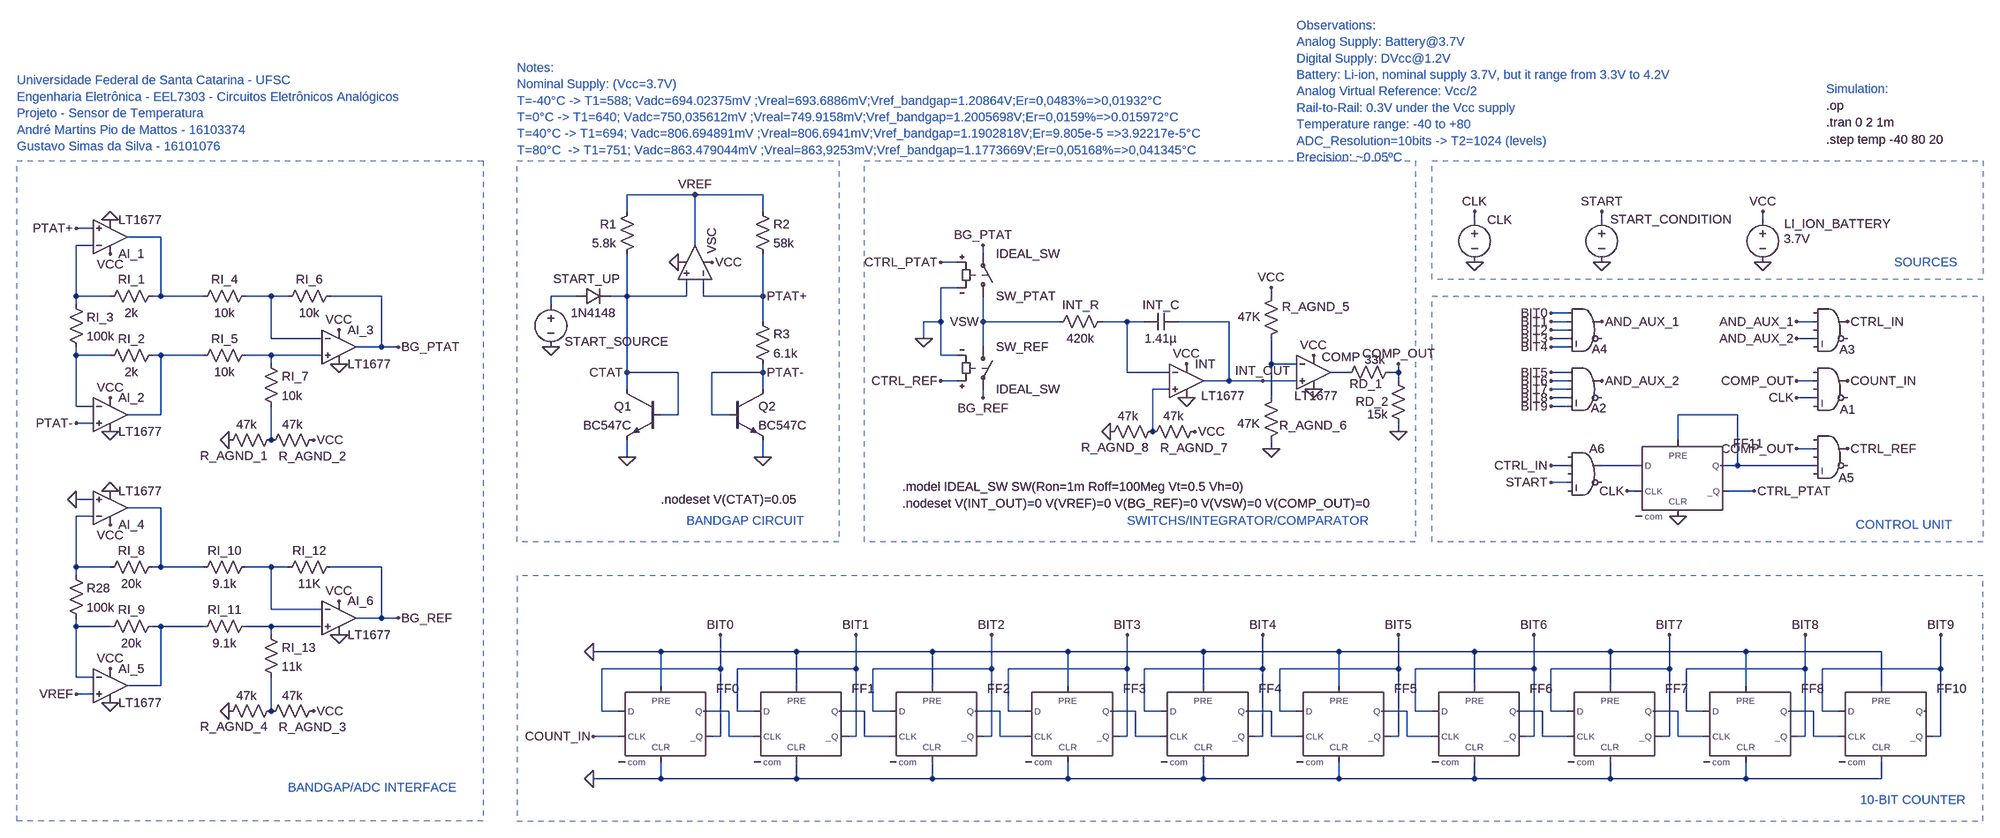
[diagram p0: schematic Temperature_Sensor_Release.asc]
Temperature_Sensor_Release.asc, the LTspice schematic file:
Version 4
SHEET 1 4048 2852
WIRE -1328 -32 -1456 -32
WIRE -1200 -32 -1328 -32
WIRE -1456 0 -1456 -32
WIRE -1200 0 -1200 -32
WIRE 144 16 144 0
WIRE 384 16 384 0
WIRE 688 16 688 0
WIRE -2464 32 -2496 32
WIRE -2336 48 -2400 48
WIRE -2464 64 -2496 64
WIRE -1328 64 -1328 -32
WIRE -784 80 -784 64
WIRE -832 96 -864 96
WIRE -832 144 -864 144
WIRE -2496 160 -2496 64
WIRE -2432 160 -2496 160
WIRE -2336 160 -2336 48
WIRE -2336 160 -2352 160
WIRE -2256 160 -2336 160
WIRE -2128 160 -2176 160
WIRE -2096 160 -2128 160
WIRE -1920 160 -2016 160
WIRE -1552 160 -1600 160
WIRE -1456 160 -1456 80
WIRE -1456 160 -1488 160
WIRE -1344 160 -1344 128
WIRE -1344 160 -1456 160
WIRE -1312 160 -1312 128
WIRE -1200 160 -1200 80
WIRE -1200 160 -1312 160
WIRE -240 160 -240 144
WIRE -2496 176 -2496 160
WIRE -1600 176 -1600 160
WIRE 320 192 288 192
WIRE -1200 208 -1200 160
WIRE -864 208 -864 144
WIRE -864 208 -896 208
WIRE -784 208 -784 160
WIRE -640 208 -784 208
WIRE -512 208 -560 208
WIRE -480 208 -512 208
WIRE -320 208 -416 208
WIRE 320 208 288 208
WIRE 784 208 752 208
WIRE 320 224 288 224
WIRE -2128 240 -2128 160
WIRE -2032 240 -2128 240
WIRE -896 240 -896 208
WIRE 320 240 288 240
WIRE 784 240 752 240
WIRE -1920 256 -1920 160
WIRE -1920 256 -1968 256
WIRE -1888 256 -1920 256
WIRE -784 256 -784 208
WIRE 320 256 288 256
WIRE -2496 272 -2496 256
WIRE -2432 272 -2496 272
WIRE -2336 272 -2352 272
WIRE -2256 272 -2336 272
WIRE -2128 272 -2176 272
WIRE -2032 272 -2128 272
WIRE -864 272 -864 208
WIRE -832 272 -864 272
WIRE -2128 288 -2128 272
WIRE -240 288 -240 240
WIRE -192 288 -240 288
WIRE -1456 304 -1456 160
WIRE -1360 304 -1456 304
WIRE -1200 304 -1200 288
WIRE -1200 304 -1296 304
WIRE -512 304 -512 208
WIRE -432 304 -512 304
WIRE -96 304 -128 304
WIRE 0 304 0 288
WIRE 0 304 -16 304
WIRE 320 304 288 304
WIRE -832 320 -864 320
WIRE -320 320 -320 208
WIRE -320 320 -368 320
WIRE -256 320 -320 320
WIRE -192 320 -256 320
WIRE 0 320 0 304
WIRE 320 320 288 320
WIRE 784 320 752 320
WIRE -1456 336 -1456 304
WIRE -1200 336 -1200 304
WIRE -432 336 -464 336
WIRE 320 336 288 336
WIRE -784 352 -784 336
WIRE -240 352 -240 288
WIRE 320 352 288 352
WIRE 784 352 752 352
WIRE -2496 368 -2496 272
WIRE -2464 368 -2496 368
WIRE 320 368 288 368
WIRE -2336 384 -2336 272
WIRE -2336 384 -2400 384
WIRE -1360 384 -1360 304
WIRE -1360 384 -1392 384
WIRE -1296 384 -1296 304
WIRE -1264 384 -1296 384
WIRE 640 384 528 384
WIRE -2464 400 -2496 400
WIRE -464 416 -464 336
WIRE 0 416 0 400
WIRE -2128 432 -2128 368
WIRE 528 432 528 384
WIRE -240 448 -240 432
WIRE 784 448 752 448
WIRE -1456 464 -1456 432
WIRE -1200 464 -1200 432
WIRE 320 480 288 480
WIRE 448 480 384 480
WIRE 640 480 640 384
WIRE 640 480 608 480
WIRE 784 480 640 480
WIRE 320 512 288 512
WIRE 448 528 432 528
WIRE 672 528 624 528
WIRE -2464 544 -2496 544
WIRE -2336 560 -2400 560
WIRE -2464 576 -2496 576
WIRE -2496 672 -2496 576
WIRE -2432 672 -2496 672
WIRE -2336 672 -2336 560
WIRE -2336 672 -2352 672
WIRE -2256 672 -2336 672
WIRE -2128 672 -2176 672
WIRE -2096 672 -2128 672
WIRE -1920 672 -2016 672
WIRE -2496 688 -2496 672
WIRE -2128 752 -2128 672
WIRE -2032 752 -2128 752
WIRE -1920 768 -1920 672
WIRE -1920 768 -1968 768
WIRE -1888 768 -1920 768
WIRE -2496 784 -2496 768
WIRE -2432 784 -2496 784
WIRE -2336 784 -2352 784
WIRE -2256 784 -2336 784
WIRE -2128 784 -2176 784
WIRE -2032 784 -2128 784
WIRE -2128 800 -2128 784
WIRE -1392 832 -1520 832
WIRE -1136 832 -1392 832
WIRE -880 832 -1136 832
WIRE -624 832 -880 832
WIRE -368 832 -624 832
WIRE -112 832 -368 832
WIRE 144 832 -112 832
WIRE 400 832 144 832
WIRE 656 832 400 832
WIRE 912 832 656 832
WIRE -1280 864 -1280 800
WIRE -1280 864 -1504 864
WIRE -1024 864 -1024 800
WIRE -1024 864 -1248 864
WIRE -768 864 -768 800
WIRE -768 864 -992 864
WIRE -512 864 -512 800
WIRE -512 864 -736 864
WIRE -256 864 -256 800
WIRE -256 864 -480 864
WIRE 0 864 0 800
WIRE 0 864 -224 864
WIRE 256 864 256 800
WIRE 256 864 32 864
WIRE 512 864 512 800
WIRE 512 864 288 864
WIRE 768 864 768 800
WIRE 768 864 544 864
WIRE 1024 864 1024 800
WIRE 1024 864 800 864
WIRE -2496 880 -2496 784
WIRE -2464 880 -2496 880
WIRE -2336 896 -2336 784
WIRE -2336 896 -2400 896
WIRE -1392 896 -1392 832
WIRE -1136 896 -1136 832
WIRE -880 896 -880 832
WIRE -624 896 -624 832
WIRE -368 896 -368 832
WIRE -112 896 -112 832
WIRE 144 896 144 832
WIRE 400 896 400 832
WIRE 656 896 656 832
WIRE 912 896 912 832
WIRE -2464 912 -2496 912
WIRE -2128 944 -2128 880
WIRE -1504 944 -1504 864
WIRE -1472 944 -1504 944
WIRE -1264 944 -1312 944
WIRE -1248 944 -1248 864
WIRE -1216 944 -1248 944
WIRE -1008 944 -1056 944
WIRE -992 944 -992 864
WIRE -960 944 -992 944
WIRE -752 944 -800 944
WIRE -736 944 -736 864
WIRE -704 944 -736 944
WIRE -496 944 -544 944
WIRE -480 944 -480 864
WIRE -448 944 -480 944
WIRE -240 944 -288 944
WIRE -224 944 -224 864
WIRE -192 944 -224 944
WIRE 16 944 -32 944
WIRE 32 944 32 864
WIRE 64 944 32 944
WIRE 272 944 224 944
WIRE 288 944 288 864
WIRE 320 944 288 944
WIRE 528 944 480 944
WIRE 544 944 544 864
WIRE 576 944 544 944
WIRE 784 944 736 944
WIRE 800 944 800 864
WIRE 832 944 800 944
WIRE -1472 992 -1520 992
WIRE -1280 992 -1280 864
WIRE -1280 992 -1296 992
WIRE -1264 992 -1264 944
WIRE -1216 992 -1264 992
WIRE -1024 992 -1024 864
WIRE -1024 992 -1040 992
WIRE -1008 992 -1008 944
WIRE -960 992 -1008 992
WIRE -768 992 -768 864
WIRE -768 992 -784 992
WIRE -752 992 -752 944
WIRE -704 992 -752 992
WIRE -512 992 -512 864
WIRE -512 992 -528 992
WIRE -496 992 -496 944
WIRE -448 992 -496 992
WIRE -256 992 -256 864
WIRE -256 992 -272 992
WIRE -240 992 -240 944
WIRE -192 992 -240 992
WIRE 0 992 0 864
WIRE 0 992 -16 992
WIRE 16 992 16 944
WIRE 64 992 16 992
WIRE 256 992 256 864
WIRE 256 992 240 992
WIRE 272 992 272 944
WIRE 320 992 272 992
WIRE 512 992 512 864
WIRE 512 992 496 992
WIRE 528 992 528 944
WIRE 576 992 528 992
WIRE 768 992 768 864
WIRE 768 992 752 992
WIRE 784 992 784 944
WIRE 832 992 784 992
WIRE 1024 992 1024 864
WIRE 1024 992 1008 992
WIRE -1392 1072 -1392 1040
WIRE -1392 1072 -1520 1072
WIRE -1136 1072 -1136 1040
WIRE -1136 1072 -1392 1072
WIRE -880 1072 -880 1040
WIRE -880 1072 -1136 1072
WIRE -624 1072 -624 1040
WIRE -624 1072 -880 1072
WIRE -368 1072 -368 1040
WIRE -368 1072 -624 1072
WIRE -112 1072 -112 1040
WIRE -112 1072 -368 1072
WIRE 144 1072 144 1040
WIRE 144 1072 -112 1072
WIRE 400 1072 400 1040
WIRE 400 1072 144 1072
WIRE 656 1072 656 1040
WIRE 656 1072 400 1072
WIRE 912 1072 912 1040
WIRE 912 1072 656 1072
FLAG -400 288 VCC
FLAG 688 96 0
FLAG 688 0 VCC
FLAG -256 320 INT_OUT
FLAG 0 288 COMP_OUT
FLAG -784 208 VSW
FLAG 144 96 0
FLAG 144 0 CLK
FLAG -1520 1072 0
FLAG -1280 800 BIT0
FLAG -1024 800 BIT1
FLAG -768 800 BIT2
FLAG -512 800 BIT3
FLAG -1520 832 0
FLAG 288 192 BIT0
FLAG 288 208 BIT1
FLAG 288 224 BIT2
FLAG 288 240 BIT3
FLAG 384 208 AND_AUX_1
FLAG -256 800 BIT4
FLAG 0 800 BIT5
FLAG 256 800 BIT6
FLAG 512 800 BIT7
FLAG 752 320 COMP_OUT
FLAG 752 352 CLK
FLAG 848 320 COUNT_IN
FLAG 288 304 BIT5
FLAG 288 320 BIT6
FLAG 288 336 BIT7
FLAG 288 352 BIT8
FLAG 384 320 AND_AUX_2
FLAG 752 208 AND_AUX_1
FLAG 752 240 AND_AUX_2
FLAG 848 208 CTRL_IN
FLAG 528 576 0
FLAG 672 528 CTRL_PTAT
FLAG 432 528 CLK
FLAG 384 96 0
FLAG 288 480 CTRL_IN
FLAG -1520 992 COUNT_IN
FLAG -864 96 CTRL_PTAT
FLAG 752 448 COMP_OUT
FLAG 848 448 CTRL_REF
FLAG 288 256 BIT4
FLAG 768 800 BIT8
FLAG 1024 800 BIT9
FLAG 288 368 BIT9
FLAG -1456 464 0
FLAG -1200 464 0
FLAG -1296 96 VCC
FLAG -1328 -32 VREF
FLAG -1200 160 PTAT+
FLAG -1200 304 PTAT-
FLAG -1456 304 CTAT
FLAG -784 64 BG_PTAT
FLAG -784 352 BG_REF
FLAG -864 320 CTRL_REF
FLAG 288 512 START
FLAG 384 0 START
FLAG -896 240 0
FLAG -2000 224 VCC
FLAG -1888 256 BG_PTAT
FLAG -2496 32 PTAT+
FLAG -2496 400 PTAT-
FLAG -2496 912 VREF
FLAG -2432 80 VCC
FLAG -2432 352 VCC
FLAG -2496 544 0
FLAG -2000 736 VCC
FLAG -1888 768 BG_REF
FLAG -2432 592 VCC
FLAG -2432 864 VCC
FLAG -160 272 VCC
FLAG -240 448 0
FLAG -160 336 0
FLAG -400 352 0
FLAG -2432 528 0
FLAG -2432 928 0
FLAG -2000 800 0
FLAG -2208 432 0
FLAG -2048 432 VCC
FLAG -240 144 VCC
FLAG -2432 16 0
FLAG -2432 416 0
FLAG -2000 288 0
FLAG -1600 256 0
FLAG -1360 96 0
FLAG -544 416 0
FLAG -384 416 VCC
FLAG -2208 944 0
FLAG -2048 944 VCC
FLAG 0 416 0
SYMBOL res -544 192 R90
WINDOW 0 0 56 VBottom 2
WINDOW 3 32 56 VTop 2
SYMATTR InstName INT_R
SYMATTR Value 420k
SYMBOL Digital\\dflop -1392 896 R0
SYMATTR InstName FF0
SYMATTR Value2 Vhigh=1.2 Trise=1u Tfall=1u Td=5u
SYMBOL Digital\\and 352 160 R0
WINDOW 0 13 100 Left 2
SYMATTR InstName A4
SYMATTR Value2 Vhigh=1.2 Trise=1u Tfall=1u Vt=0.01
SYMBOL cap -416 192 R90
WINDOW 0 0 32 VBottom 2
WINDOW 3 32 32 VTop 2
SYMATTR InstName INT_C
SYMATTR Value 1.41µ
SYMBOL voltage 688 0 M0
WINDOW 3 -89 52 Left 2
WINDOW 123 0 0 Left 0
WINDOW 39 24 44 Left 2
WINDOW 0 -241 23 Left 2
SYMATTR Value 3.7V
SYMATTR InstName LI_ION_BATTERY
SYMBOL Digital\\dflop -1136 896 R0
SYMATTR InstName FF1
SYMATTR Value2 Vhigh=1.2 Trise=1u Tfall=1u Td=5u
SYMBOL Digital\\dflop -880 896 R0
SYMATTR InstName FF2
SYMATTR Value2 Vhigh=1.2 Trise=1u Tfall=1u Td=5u
SYMBOL Digital\\dflop -624 896 R0
SYMATTR InstName FF3
SYMATTR Value2 Vhigh=1.2 Trise=1u Tfall=1u Td=5u
SYMBOL voltage 144 0 R0
WINDOW 3 24 44 Invisible 2
WINDOW 123 0 0 Left 0
WINDOW 39 24 44 Left 2
SYMATTR Value PULSE(0 1.2 1m 25u 25u 0.5m 1m)
SYMATTR InstName CLK
SYMBOL Digital\\dflop -368 896 R0
SYMATTR InstName FF4
SYMATTR Value2 Vhigh=1.2 Trise=1u Tfall=1u Td=5u
SYMBOL Digital\\dflop -112 896 R0
SYMATTR InstName FF5
SYMATTR Value2 Vhigh=1.2 Trise=1u Tfall=1u Td=5u
SYMBOL Digital\\dflop 144 896 R0
SYMATTR InstName FF6
SYMATTR Value2 Vhigh=1.2 Trise=1u Tfall=1u Td=5u
SYMBOL Digital\\dflop 400 896 R0
SYMATTR InstName FF7
SYMATTR Value2 Vhigh=1.2 Trise=1u Tfall=1u Td=5u
SYMBOL Digital\\and 816 272 R0
WINDOW 0 18 102 Left 2
SYMATTR InstName A1
SYMATTR Value2 Vhigh=1.2 Trise=1u Tfall=1u Vt=0.01
SYMBOL Digital\\and 352 272 R0
WINDOW 0 12 100 Left 2
SYMATTR InstName A2
SYMATTR Value2 Vhigh=1.2 Trise=1u Tfall=1u Vt=0.01
SYMBOL Digital\\and 816 160 R0
WINDOW 0 17 101 Left 2
SYMATTR InstName A3
SYMATTR Value2 Vhigh=1.2 Trise=1u Tfall=1u Vt=0.01
SYMBOL Digital\\dflop 528 432 R0
SYMATTR InstName FF11
SYMATTR Value2 Vhigh=1.2 Trise=1u Tfall=1u Td=5u
SYMBOL voltage 384 0 R0
WINDOW 3 24 44 Invisible 2
WINDOW 123 0 0 Left 0
WINDOW 39 24 44 Left 2
WINDOW 0 16 15 Left 2
SYMATTR Value PULSE(0 3.3 30m 0 0 10 10)
SYMATTR InstName START_CONDITION
SYMBOL Digital\\and 352 432 R0
SYMATTR InstName A6
SYMATTR Value2 Vhigh=1.2 Trise=1u Tfall=1u Vt=0.01
SYMBOL Digital\\and 816 400 R0
WINDOW 0 15 103 Left 2
SYMATTR InstName A5
SYMATTR Value2 Vhigh=1.2 Trise=1u Tfall=1u Vt=0.01
SYMBOL Digital\\dflop 656 896 R0
SYMATTR InstName FF8
SYMATTR Value2 Vhigh=1.2 Trise=1u Tfall=1u Td=5u
SYMBOL Digital\\dflop 912 896 R0
SYMATTR InstName FF10
SYMATTR Value2 Vhigh=1.2 Trise=1u Tfall=1u Td=5u
SYMBOL npn -1392 336 M0
SYMATTR InstName Q1
SYMATTR Value BC547C
SYMBOL res -1440 -16 M0
SYMATTR InstName R1
SYMATTR Value 5.8k
SYMBOL res -1216 -16 R0
SYMATTR InstName R2
SYMATTR Value 58k
SYMBOL res -1216 192 R0
SYMATTR InstName R3
SYMATTR Value 6.1k
SYMBOL npn -1264 336 R0
SYMATTR InstName Q2
SYMATTR Value BC547C
SYMBOL Opamps\\UniversalOpamp2 -1328 96 M270
SYMATTR InstName VSC
SYMBOL sw -784 176 M180
SYMATTR InstName SW_PTAT
SYMATTR Value IDEAL_SW
SYMBOL sw -784 240 R0
SYMATTR InstName SW_REF
SYMATTR Value IDEAL_SW
SYMBOL res -2000 144 R90
WINDOW 0 0 56 VBottom 2
WINDOW 3 32 56 VTop 2
SYMATTR InstName RI_6
SYMATTR Value 10k
SYMBOL res -2160 144 R90
WINDOW 0 0 56 VBottom 2
WINDOW 3 32 56 VTop 2
SYMATTR InstName RI_4
SYMATTR Value 10k
SYMBOL res -2160 256 R90
WINDOW 0 0 56 VBottom 2
WINDOW 3 32 56 VTop 2
SYMATTR InstName RI_5
SYMATTR Value 10k
SYMBOL res -2144 272 R0
SYMATTR InstName RI_7
SYMATTR Value 10k
SYMBOL res -2512 160 R0
SYMATTR InstName RI_3
SYMATTR Value 100k
SYMBOL res -2000 656 R90
WINDOW 0 0 56 VBottom 2
WINDOW 3 32 56 VTop 2
SYMATTR InstName RI_12
SYMATTR Value 11K
SYMBOL res -2160 656 R90
WINDOW 0 0 56 VBottom 2
WINDOW 3 32 56 VTop 2
SYMATTR InstName RI_10
SYMATTR Value 9.1k
SYMBOL res -2160 768 R90
WINDOW 0 0 56 VBottom 2
WINDOW 3 32 56 VTop 2
SYMATTR InstName RI_11
SYMATTR Value 9.1k
SYMBOL res -2144 784 R0
SYMATTR InstName RI_13
SYMATTR Value 11k
SYMBOL res -2336 656 R90
WINDOW 0 0 56 VBottom 2
WINDOW 3 32 56 VTop 2
SYMATTR InstName RI_8
SYMATTR Value 20k
SYMBOL res -2512 672 R0
SYMATTR InstName R28
SYMATTR Value 100k
SYMBOL res -2336 768 R90
WINDOW 0 0 56 VBottom 2
WINDOW 3 32 56 VTop 2
SYMATTR InstName RI_9
SYMATTR Value 20k
SYMBOL res -2336 144 R90
WINDOW 0 0 56 VBottom 2
WINDOW 3 32 56 VTop 2
SYMATTR InstName RI_1
SYMATTR Value 2k
SYMBOL res -2336 256 R90
WINDOW 0 0 56 VBottom 2
WINDOW 3 32 56 VTop 2
SYMATTR InstName RI_2
SYMATTR Value 2k
SYMBOL res -224 144 M0
WINDOW 0 -131 36 Left 2
WINDOW 3 36 55 Left 2
SYMATTR InstName R_AGND_5
SYMATTR Value 47K
SYMBOL res -224 336 M0
WINDOW 0 -126 68 Left 2
WINDOW 3 37 65 Left 2
SYMATTR InstName R_AGND_6
SYMATTR Value 47K
SYMBOL res -2032 416 R90
WINDOW 0 62 18 VBottom 2
WINDOW 3 -29 56 VTop 2
SYMATTR InstName R_AGND_2
SYMATTR Value 47k
SYMBOL res -2112 416 R90
WINDOW 0 61 87 VBottom 2
WINDOW 3 -29 62 VTop 2
SYMATTR InstName R_AGND_1
SYMATTR Value 47k
SYMBOL Opamps\\LT1677 -2000 192 R0
SYMATTR InstName AI_3
SYMBOL Opamps\\LT1677 -2432 320 R0
SYMATTR InstName AI_2
SYMBOL Opamps\\LT1677 -2432 112 M180
SYMATTR InstName AI_1
SYMBOL Opamps\\LT1677 -2000 704 R0
SYMATTR InstName AI_6
SYMBOL Opamps\\LT1677 -2432 832 R0
SYMATTR InstName AI_5
SYMBOL Opamps\\LT1677 -2432 624 M180
SYMATTR InstName AI_4
SYMBOL voltage -1600 160 R0
WINDOW 0 26 86 Left 2
WINDOW 3 24 96 Invisible 2
WINDOW 123 0 0 Left 0
WINDOW 39 0 0 Left 0
SYMATTR InstName START_SOURCE
SYMATTR Value PULSE(0 1 0 0.1m 0.1m 1m 1m 1)
SYMBOL diode -1552 176 R270
WINDOW 0 33 19 VTop 2
WINDOW 3 0 32 VBottom 2
SYMATTR InstName START_UP
SYMATTR Value 1N4148
SYMBOL Opamps\\LT1677 -400 256 R0
WINDOW 3 28 92 Left 2
SYMATTR InstName INT
SYMBOL Opamps\\LT1677 -160 240 R0
WINDOW 0 15 35 Left 2
WINDOW 3 -36 108 Left 2
SYMATTR InstName COMP
SYMBOL res -368 400 R90
WINDOW 0 62 18 VBottom 2
WINDOW 3 -29 56 VTop 2
SYMATTR InstName R_AGND_7
SYMATTR Value 47k
SYMBOL res -448 400 R90
WINDOW 0 61 87 VBottom 2
WINDOW 3 -29 62 VTop 2
SYMATTR InstName R_AGND_8
SYMATTR Value 47k
SYMBOL res -2032 928 R90
WINDOW 0 62 18 VBottom 2
WINDOW 3 -29 56 VTop 2
SYMATTR InstName R_AGND_3
SYMATTR Value 47k
SYMBOL res -2112 928 R90
WINDOW 0 61 87 VBottom 2
WINDOW 3 -29 62 VTop 2
SYMATTR InstName R_AGND_4
SYMATTR Value 47k
SYMBOL res 0 288 R90
WINDOW 0 53 61 VBottom 2
WINDOW 3 -24 44 VTop 2
SYMATTR InstName RD_1
SYMATTR Value 33k
SYMBOL res 16 416 R180
WINDOW 0 35 57 Left 2
WINDOW 3 36 33 Left 2
SYMATTR InstName RD_2
SYMATTR Value 15k
TEXT 872 1112 Left 2 ;10-BIT COUNTER
TEXT -512 584 Left 2 ;SWITCHS/INTEGRATOR/COMPARATOR
TEXT 864 592 Left 2 ;CONTROL UNIT
TEXT 808 -136 Left 2 !.step temp -40 80 20
TEXT -1344 584 Left 2 ;BANDGAP CIRCUIT
TEXT -2096 1088 Left 2 ;BANDGAP/ADC INTERFACE
TEXT -2608 -248 Left 2 ;Universidade Federal de Santa Catarina - UFSC\nEngenharia Eletrônica - EEL7303 - Circuitos Eletrônicos Analógicos\nProjeto - Sensor de Temperatura\nAndré Martins Pio de Mattos - 16103374\nGustavo Simas da Silva - 16101076
TEXT 808 -168 Left 2 !.tran 0 2 1m
TEXT 808 -200 Left 2 !.op
TEXT -936 552 Left 2 !.nodeset V(INT_OUT)=0 V(VREF)=0 V(BG_REF)=0 V(VSW)=0 V(COMP_OUT)=0
TEXT -1392 544 Left 2 !.nodeset V(CTAT)=0.05
TEXT -936 520 Left 2 !.model IDEAL_SW SW(Ron=1m Roff=100Meg Vt=0.5 Vh=0)
TEXT -192 -352 Left 2 ;Observations:\nAnalog Supply: Battery@3.7V\nDigital Supply: DVcc@1.2V\nBattery: Li-ion, nominal supply 3.7V, but it range from 3.3V to 4.2V\nAnalog Virtual Reference: Vcc/2\nRail-to-Rail: 0.3V under the Vcc supply\nTemperature range: -40 to +80\nADC_Resolution=10bits -> T2=1024 (levels)\nPrecision: ~0.05ºC
TEXT 936 96 Left 2 ;SOURCES
TEXT -1664 -272 Left 2 ;Notes:\nNominal Supply: (Vcc=3.7V)\nT=-40°C -> T1=588; Vadc=694.02375mV ;Vreal=693.6886mV;Vref_bandgap=1.20864V;Er=0,0483%=>0,01932°C\nT=0°C -> T1=640; Vadc=750,035612mV ;Vreal=749.9158mV;Vref_bandgap=1.2005698V;Er=0,0159%=>0.015972°C\nT=40°C -> T1=694; Vadc=806.694891mV ;Vreal=806.6941mV;Vref_bandgap=1.1902818V;Er=9.805e-5 =>3.92217e-5°C\nT=80°C  -> T1=751; Vadc=863.479044mV ;Vreal=863,9253mV;Vref_bandgap=1.1773669V;Er=0,05168%=>0,041345°C
TEXT 808 -232 Left 2 ;Simulation:
RECTANGLE Normal -1664 1152 1104 688 2
RECTANGLE Normal -1664 -96 -1056 624 2
RECTANGLE Normal -2608 -96 -1728 1152 2
RECTANGLE Normal 32 624 -1008 -96 2
RECTANGLE Normal 64 160 1104 624 2
RECTANGLE Normal 1104 128 64 -96 2

The netlist it stands for:
* Temperature_Sensor_Release.asc
R§INT_R N005 VSW 420k
A§FF0 BIT0 0 COUNT_IN 0 0 BIT0 N022 0 DFLOP Vhigh=1.2 Trise=1u Tfall=1u Td=5u
A4 BIT0 BIT1 BIT2 BIT3 BIT4 0 AND_AUX_1 0 AND Vhigh=1.2 Trise=1u Tfall=1u Vt=0.01
C§INT_C INT_OUT N005 1.41µ
V§LI_ION_BATTERY VCC 0 3.7V
A§FF1 BIT1 0 N022 0 0 BIT1 N023 0 DFLOP Vhigh=1.2 Trise=1u Tfall=1u Td=5u
A§FF2 BIT2 0 N023 0 0 BIT2 N024 0 DFLOP Vhigh=1.2 Trise=1u Tfall=1u Td=5u
A§FF3 BIT3 0 N024 0 0 BIT3 N025 0 DFLOP Vhigh=1.2 Trise=1u Tfall=1u Td=5u
V§CLK CLK 0 PULSE(0 1.2 1m 25u 25u 0.5m 1m)
A§FF4 BIT4 0 N025 0 0 BIT4 N026 0 DFLOP Vhigh=1.2 Trise=1u Tfall=1u Td=5u
A§FF5 BIT5 0 N026 0 0 BIT5 N027 0 DFLOP Vhigh=1.2 Trise=1u Tfall=1u Td=5u
A§FF6 BIT6 0 N027 0 0 BIT6 N028 0 DFLOP Vhigh=1.2 Trise=1u Tfall=1u Td=5u
A§FF7 BIT7 0 N028 0 0 BIT7 N029 0 DFLOP Vhigh=1.2 Trise=1u Tfall=1u Td=5u
A1 0 COMP_OUT 0 CLK 0 0 COUNT_IN 0 AND Vhigh=1.2 Trise=1u Tfall=1u Vt=0.01
A2 BIT5 BIT6 BIT7 BIT8 BIT9 0 AND_AUX_2 0 AND Vhigh=1.2 Trise=1u Tfall=1u Vt=0.01
A3 0 AND_AUX_1 0 AND_AUX_2 0 0 CTRL_IN 0 AND Vhigh=1.2 Trise=1u Tfall=1u Vt=0.01
A§FF11 N014 0 CLK N012 0 CTRL_PTAT N012 0 DFLOP Vhigh=1.2 Trise=1u Tfall=1u Td=5u
V§START_CONDITION START 0 PULSE(0 3.3 30m 0 0 10 10)
A6 0 CTRL_IN 0 START 0 0 N014 0 AND Vhigh=1.2 Trise=1u Tfall=1u Vt=0.01
A5 0 COMP_OUT 0 N012 0 0 CTRL_REF 0 AND Vhigh=1.2 Trise=1u Tfall=1u Vt=0.01
A§FF8 BIT8 0 N029 0 0 BIT8 N030 0 DFLOP Vhigh=1.2 Trise=1u Tfall=1u Td=5u
A§FF10 BIT9 0 N030 0 0 BIT9 0 0 DFLOP Vhigh=1.2 Trise=1u Tfall=1u Td=5u
Q1 CTAT CTAT 0 0 BC547C
R1 VREF CTAT 5.8k
R2 VREF PTAT+ 58k
R3 PTAT+ PTAT- 6.1k
Q2 PTAT- PTAT- 0 0 BC547C
XVSC CTAT PTAT+ VCC 0 VREF level.2 Avol=1Meg GBW=10Meg Slew=10Meg ilimit=25m rail=0 Vos=0 phimargin=45 en=0 enk=0 in=0 ink=0 Rin=500Meg  ; pins IN+ IN- V+ V- OUT
SW_PTAT VSW BG_PTAT CTRL_PTAT 0 IDEAL_SW
SW_REF VSW BG_REF CTRL_REF 0 IDEAL_SW
RI_6 BG_PTAT N003 10k
RI_4 N003 N001 10k
RI_5 N008 N007 10k
RI_7 N008 N013 10k
RI_3 N002 N006 100k
RI_12 BG_REF N017 11K
RI_10 N017 N015 9.1k
RI_11 N020 N019 9.1k
RI_13 N020 N021 11k
RI_8 N015 N016 20k
R28 N016 N018 100k
RI_9 N019 N018 20k
RI_1 N001 N002 2k
RI_2 N007 N006 2k
R_AGND_5 VCC N009 47K
R_AGND_6 N009 0 47K
R_AGND_2 VCC N013 47k
R_AGND_1 N013 0 47k
XAI_3 N008 N003 VCC 0 BG_PTAT LT1677  ; pins In+ In- V+ V- OUT
XAI_2 PTAT- N006 VCC 0 N007 LT1677  ; pins In+ In- V+ V- OUT
XAI_1 PTAT+ N002 VCC 0 N001 LT1677  ; pins In+ In- V+ V- OUT
XAI_6 N020 N017 VCC 0 BG_REF LT1677  ; pins In+ In- V+ V- OUT
XAI_5 VREF N018 VCC 0 N019 LT1677  ; pins In+ In- V+ V- OUT
XAI_4 0 N016 VCC 0 N015 LT1677  ; pins In+ In- V+ V- OUT
V§START_SOURCE N004 0 PULSE(0 1 0 0.1m 0.1m 1m 1m 1)
D§START_UP N004 CTAT 1N4148
XINT N011 N005 VCC 0 INT_OUT LT1677  ; pins In+ In- V+ V- OUT
XCOMP INT_OUT N009 VCC 0 N010 LT1677  ; pins In+ In- V+ V- OUT
R_AGND_7 VCC N011 47k
R_AGND_8 N011 0 47k
R_AGND_3 VCC N021 47k
R_AGND_4 N021 0 47k
RD_1 COMP_OUT N010 33k
RD_2 0 COMP_OUT 15k
.model D D
.lib standard.dio
.model NPN NPN
.model PNP PNP
.lib standard.bjt
* 10-BIT COUNTER
* SWITCHS/INTEGRATOR/COMPARATOR
* CONTROL UNIT
.step temp -40 80 20
* BANDGAP CIRCUIT
* BANDGAP/ADC INTERFACE
* Universidade Federal de Santa Catarina - UFSC
* Engenharia Eletrônica - EEL7303 - Circuitos Eletrônicos Analógicos
* Projeto - Sensor de Temperatura
* André Martins Pio de Mattos - 16103374
* Gustavo Simas da Silva - 16101076
.tran 0 2 1m
.op
.nodeset V(INT_OUT)=0 V(VREF)=0 V(BG_REF)=0 V(VSW)=0 V(COMP_OUT)=0
.nodeset V(CTAT)=0.05
.model IDEAL_SW SW(Ron=1m Roff=100Meg Vt=0.5 Vh=0)
* Observations:
* Analog Supply: Battery@3.7V
* Digital Supply: DVcc@1.2V
* Battery: Li-ion, nominal supply 3.7V, but it range from 3.3V to 4.2V
* Analog Virtual Reference: Vcc/2
* Rail-to-Rail: 0.3V under the Vcc supply
* Temperature range: -40 to +80
* ADC_Resolution=10bits -> T2=1024 (levels)
* Precision: ~0.05ºC
* SOURCES
* Notes:
* Nominal Supply: (Vcc=3.7V)
* T=-40°C -> T1=588; Vadc=694.02375mV ;Vreal=693.6886mV;Vref_bandgap=1.20864V;Er=0,0483%=>0,01932°C
* T=0°C -> T1=640; Vadc=750,035612mV ;Vreal=749.9158mV;Vref_bandgap=1.2005698V;Er=0,0159%=>0.015972°C
* T=40°C -> T1=694; Vadc=806.694891mV ;Vreal=806.6941mV;Vref_bandgap=1.1902818V;Er=9.805e-5 =>3.92217e-5°C
* T=80°C  -> T1=751; Vadc=863.479044mV ;Vreal=863,9253mV;Vref_bandgap=1.1773669V;Er=0,05168%=>0,041345°C
* Simulation:
.lib UniversalOpamps2.sub
.lib LTC.lib
.backanno
.end